# Altium schematic sheet llrf_afe_dds_filter.SchDoc: =GlobalProjectName
size 209 x 297 mm; SheetNumber: 20; SheetTotal: 20; PageSetup: Record=PageOptions|CenterHorizontal=True|CenterVertical=True|PrintScale=1.00|XCorrection=1.00|YCorrection=1.00|PrintKind=1|BorderSize=5000000|LeftOffset=0|BottomOffset=0|Orientation=2|PaperLength=1000|PaperWidth=1000|Scale=100|PaperSource=15|PrintQuality=1200|MediaType=1|DitherType=10|PaperKind=A3|PrintScaleMode=1; Weight: -; ScaleFactor: -
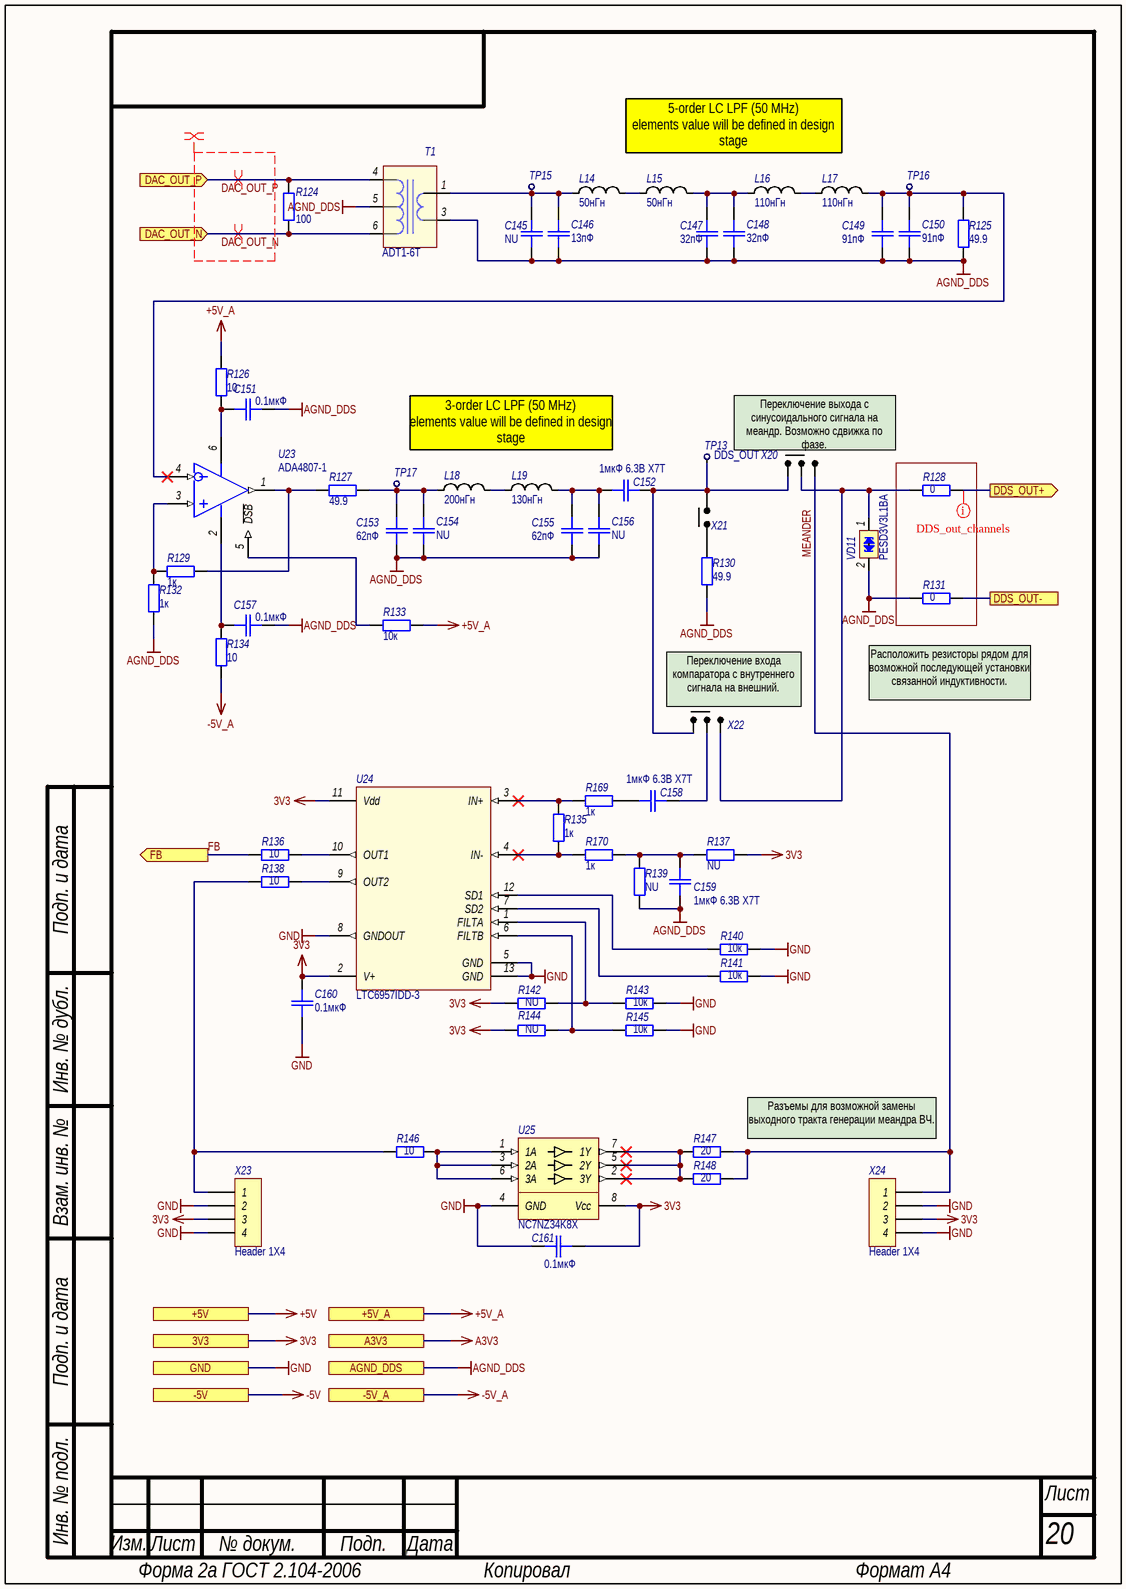
[diagram p0: llrf_afe_dds_filter.SchDoc]

## Parts
C145  NU  [SMD_C0603]
C146  13пФ  [SMD_C0603]
C147  32пФ  [SMD_C0603]
C148  32пФ  [SMD_C0603]
C149  91пФ  [SMD_C0603]
C150  91пФ  [SMD_C0603]
C151  0.1мкФ  [SMD_C0402]
C152  1мкФ 6.3В X7T  [SMD_C0603]
C153  62пФ  [SMD_C0603]
C154  NU  [SMD_C0603]
C155  62пФ  [SMD_C0603]
C156  NU  [SMD_C0603]
C157  0.1мкФ  [SMD_C0402]
C158  1мкФ 6.3В X7T  [SMD_C0603]
C159  1мкФ 6.3В X7T  [SMD_C0603]
C160  0.1мкФ  [SMD_C0402]
C161  0.1мкФ  [SMD_C0402]
L14  50нГн  [SMD_0805]
L15  50нГн  [SMD_0805]
L16  110нГн  [SMD_0805]
L17  110нГн  [SMD_0805]
L18  200нГн  [SMD_0805]
L19  130нГн  [SMD_0805]
R124  100  [SMD_0603]
R125  49.9  [SMD_0603]
R126  10  [SMD_0603]
R127  49.9  [SMD_0603]
R128  0  [SMD_0603]
R129  1к  [SMD_0603]
R130  49.9  [SMD_0603]
R131  0  [SMD_0603]
R132  1к  [SMD_0603]
R133  10к  [SMD_0603]
R134  10  [SMD_0603]
R135  1к  [SMD_0603]
R136  10  [SMD_0603]
R137  NU  [SMD_0603]
R138  10  [SMD_0603]
R139  NU  [SMD_0603]
R140  10к  [SMD_0603]
R141  10к  [SMD_0603]
R142  NU  [SMD_0603]
R143  10к  [SMD_0603]
R144  NU  [SMD_0603]
R145  10к  [SMD_0603]
R146  10  [SMD_0603]
R147  20  [SMD_1206]
R148  20  [SMD_1206]
R169  1к  [SMD_0603]
R170  1к  [SMD_0603]
T1  ADT1-6T  [ADT1-6T]
TP13  DDS_OUT  [TestPoint]
TP15  (no value)  [TestPoint]
TP16  (no value)  [TestPoint]
TP17  (no value)  [TestPoint]
U23  ADA4807-1  [SOT23-6]
U24  LTC6957IDD-3  [DFN-12_EP_3x3_0.45]
U25  Наименование: NC7NZ34K8X  [US-8]  (hidden comment: NC7NZ34)
VD11  Наименование: PESD3V3L1BA  [SOD-323]  (hidden comment: PESD3V3)
X20  Jumper 3  [PLS-3]  (value not drawn)
X21  Jumper 2  [PLS-2]  (value not drawn)
X22  Jumper 3  [PLS-3]  (value not drawn)
X23  Header 1X4  [PLS-4]
X24  Header 1X4  [PLS-4]

## Ports
3V3, +5V, +5V_A, -5V, -5V_A, A3V3, AGND_DDS, DAC_OUT_N (in), DAC_OUT_P (in), DDS_OUT+ (out), DDS_OUT-, FB (out), GND

## Nets
3V3: C160.1 C161.1 R137.2 R142.2 R144.2 U24.2(V+) U24.11(Vdd) U25.8(Vcc) X23.3 X24.3 ; port 3V3
+5V: port +5V
+5V_A: R126.1 R133.2 ; port +5V_A
-5V: port -5V
-5V_A: R134.1 ; port -5V_A
A3V3: port A3V3
AGND_DDS: C145.2 C146.2 C147.2 C148.2 C149.2 C150.2 C151.1 C153.2 C154.2 C155.2 C156.2 C157.1 C159.2 R125.1 R130.1 R131.1 R132.1 R139.1 T1.3 T1.5 VD11.2(cathode_2) ; port AGND_DDS
GND: C160.2 C161.2 R140.1 R141.1 R143.1 R145.1 U24.5(GND) U24.8(GNDOUT) U24.13(GND) U25.4(GND) X23.2 X23.4 X24.2 X24.4 ; port GND
DAC_OUT_N: R124.2 T1.6 ; port DAC_OUT_N
DAC_OUT_P: R124.1 T1.4 ; port DAC_OUT_P
DDS_OUT+: R128.2 ; port DDS_OUT+
DDS_OUT-: R131.2 ; port DDS_OUT-
FB: R136.1 ; port FB
MEANDER: R147.2 R148.2 X20.3 X24.1
NetC145_1: C145.1 C146.1 L14.1 T1.1 TP15.0(TP)
NetC147_1: C147.1 C148.1 L15.2 L16.1
NetC149_1: C149.1 C150.1 L17.2 R125.2 TP16.0(TP) U23.4(IN-)
NetC151_2: C151.2 R126.2 U23.6(V+)
NetC152_1: C152.1 TP13.0(TP) X20.1 X21.2 X22.1
NetC152_2: C152.2 C155.1 C156.1 L19.2
NetC153_1: C153.1 C154.1 L18.1 R127.2 TP17.0(TP)
NetC157_2: C157.2 R134.2 U23.2(V-)
NetC158_1: C158.1 X22.2
NetC158_2: C158.2 R169.2
NetC159_1: C159.1 R137.1 R139.2 R170.2
NetL14_2: L14.2 L15.1
NetL16_2: L16.2 L17.1
NetL18_2: L18.2 L19.1
NetR127_1: R127.1 R129.2 U23.1(OUT)
NetR128_1: R128.1 VD11.1(cathode_1) X20.2 X22.3
NetR129_1: R129.1 R132.2 U23.3(IN+)
NetR130_2: R130.2 X21.1
NetR133_1: R133.1 U23.5(~{DSB})
NetR135_1: R135.1 R169.1 U24.3(IN+)
NetR135_2: R135.2 R170.1 U24.4(IN-)
NetR136_2: R136.2 U24.10(OUT1)
NetR138_1: R138.1 R146.1 X23.1
NetR138_2: R138.2 U24.9(OUT2)
NetR140_2: R140.2 U24.12(SD1)
NetR141_2: R141.2 U24.7(SD2)
NetR142_1: R142.1 R143.2 U24.1(FILTA)
NetR144_1: R144.1 R145.2 U24.6(FILTB)
NetR146_2: R146.2 U25.1(1A) U25.3(2A) U25.6(3A)
NetR147_1: R147.1 R148.1 U25.2(3Y) U25.5(2Y) U25.7(1Y)

## Layout directives
differential pair: DAC_OUT_N, DAC_OUT_P
net class DDS_diff_pair: DAC_OUT_N, DAC_OUT_P
net class DDS_out_channels: DDS_OUT+

## Notes on the sheet
- 5-order LC LPF (50 MHz)
  elements value will be defined in design stage
- 3-order LC LPF (50 MHz)
  elements value will be defined in design stage
- (near X20) Переключение выхода с синусоидального сигнала на меандр. Возможно сдвижка по фазе.
- (near X22) Переключение входа компаратора с внутреннего сигнала на внешний.
- (near R131) Расположить резисторы рядом для возможной последующей установки связанной индуктивности.
- Разъемы для возможной замены выходного тракта генерации меандра ВЧ.
- Подп. и дата
- Инв. № дубл.
- Взам. инв. №
- Инв. № подл.
- Изм.
- Лист
- № докум.
- Подп.
- Дата
- Форма 2а ГОСТ 2.104-2006
- Копировал
- Формат А4

## Library data of the parts
C145-C151 C153-C157 C160 = Capacitor: Назначение: SMD-конденсатор; Наименование: Конденсатор; Потребление, Вт: 0
  C145 C154 C156: Value: NU
  C146: Value: 13пФ
  C147 C148: Value: 32пФ
  C149 C150: Value: 91пФ
  C151 C157 C160: Value: 0.1мкФ
  C153 C155: Value: 62пФ
C152 C158 C159 = Capacitor: Назначение: SMD-конденсатор; Наименование: GRM033D70J105ME01; Потребление, Вт: 0; Value: 1мкФ 6.3В X7T
C161 = Capacitor: Назначение: SMD-конденсатор; Наименование: Конденсатор; Потребление, Вт: 0; Точность: %; Напряжение: В; Value: 0.1мкФ; Диэлектрик: *
L14-L19 = Inductor: Наименование: Индуктивность; Назначение: SMD-индуктивность; Потребление, Вт: 0.01
  L14 L15: Value: 50нГн
  L16 L17: Value: 110нГн
  L18: Value: 200нГн
  L19: Value: 130нГн
R124-R148 R169 R170 = Resistor: Наименование: Резистор; Назначение: SMD-резистор; Потребление, Вт: 0,001
  R124: Value: 100
  R125 R127 R130: Value: 49.9
  R126 R134 R136 R138 R146: Value: 10
  R128 R131: Value: 0
  R129 R132 R135 R169 R170: Value: 1к
  R133 R140 R141 R143 R145: Value: 10к
  R137 R139 R142 R144: Value: NU
  R147 R148: Value: 20
T1 = ADT1-6T: RF Transformer 50Ω 0.03 to 125MHz; Потребление, Вт: 0,01; Назначение: RF Transformer 50Ω 0.03 to 125MHz; ComponentLink1Description: DataSheet; ComponentLink1URL: https://www.minicircuits.com/pdfs/ADT1-6T.pdf; Наименование: ADT1-6T
TP13 TP15-TP17 = TP: Наименование: Точка проверки; Назначение: Контроль параметров платы
  TP13: TP_Name: DDS_OUT
U23 = ADA4807-1: Rail-to-Rail Input/Output Amplifiers, 3.1 nV/√Hz, 1 mA, 180 MHz; Потребление, Вт: 0,01; Назначение: Rail-to-Rail Input/Output Amplifiers, 3.1 nV/√Hz, 1 mA, 180 MHz; ComponentLink1Description: DataSheet; ComponentLink1URL: https://www.analog.com/media/en/technical-documentation/data-sheets/ADA4807-1_4807-2_4807-4.pdf; Наименование: ADA4807-1; Supplier 1: Digi-Key; Supplier Part Number 1: ADA4807-1AKSZ-R2CT-ND
U24 = LTC6957IDD-3: Low Phase Noise, Dual Output Buffer/Driver/Logic Converter; Назначение: Dual output clock buffer; Потребление, Вт: 0.1; Supplier 1: Arrow Electronics; Supplier Part Number 1: LTC6957IDD-3#PBF; Наименование: LTC6957IDD-3
U25 = NC7NZ34: TinyLogic UHS Triple Buffer; Потребление, Вт: 0.01; Назначение: TinyLogic UHS Triple Buffer; ComponentLink1Description: DataSheet; ComponentLink1URL: https://www.onsemi.com/pdf/datasheet/nc7nz34-d.pdf; Supplier 1: Digi-Key; Supplier Part Number 1: NC7NZ34K8XCT-ND
VD11 = PESDxL1BA: Low capacitance bidirectional ESD protection diodes; Назначение: ESD защитные диоды; Потребление, Вт: 0.0; ComponentLink1Description: DataSheet; ComponentLink1URL: https://static.chipdip.ru/lib/635/DOC005635911.pdf
X20 X22 = Jumper 3: Jumper, 3-Pin, Dual row; Потребление, Вт: 0,0; Наименование: Jumper 3-pin; Назначение: Jumper, 3-Pin, Dual row
X21 = Jumper 2: Jumper, 2-Pin, Dual row; Потребление, Вт: 0,0; Наименование: Jumper 2-pin; Назначение: Jumper, 2-Pin, Dual row
X23 X24 = Header 1X4: Header, 4-Pin, Single row; Потребление, Вт: 0,0; Назначение: Header, 4-Pin, Single row; Наименование: Header 1X4